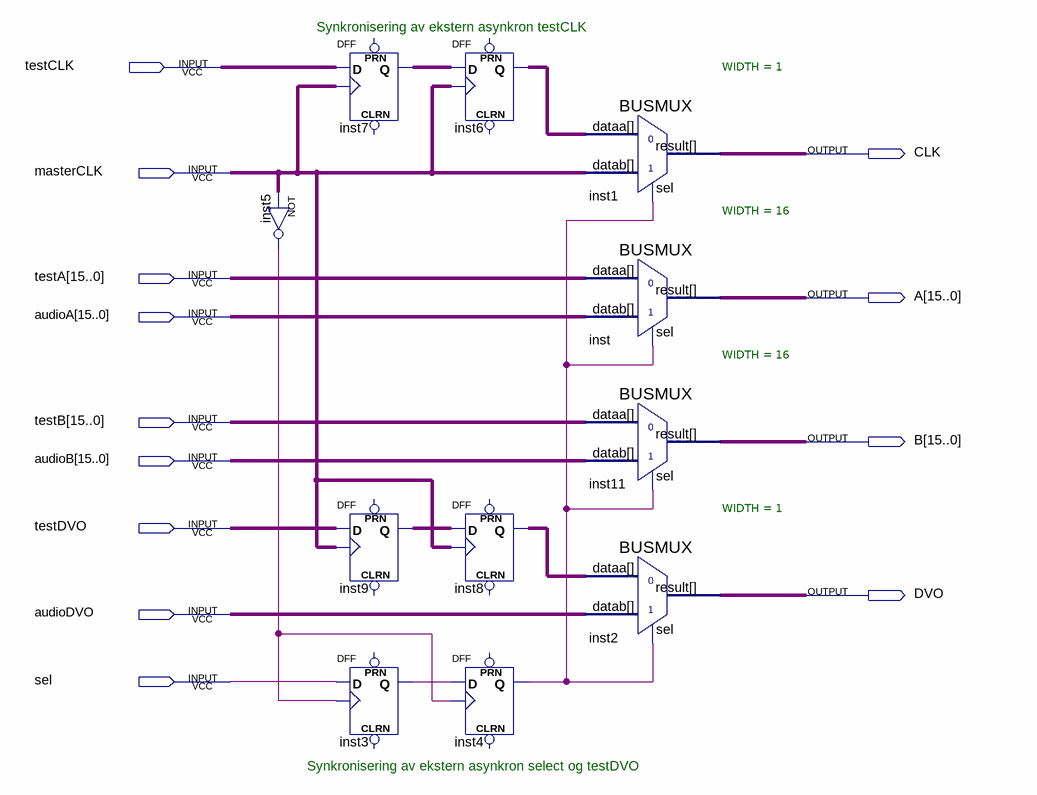
[diagram p0: schematic sheet]
// Quartus schematic wb_dataCtrlMux.bdf as structural Verilog: 11 symbols, 13 pins
module wb_dataCtrlMux (
  input  testCLK,
  input  masterCLK,
  input  [15:0] testA,
  input  [15:0] audioA,
  input  [15:0] testB,
  input  [15:0] audioB,
  input  testDVO,
  input  audioDVO,
  input  sel,
  output CLK,
  output [15:0] A,
  output [15:0] B,
  output DVO
);

  wire inst3_q, inst4_q, inst5_out, inst6_q, inst7_q, inst8_q, inst9_q;

  not inst5 (inst5_out, masterCLK);
  DFF inst7 (.CLK(masterCLK), .D(testCLK), .Q(inst7_q));  // open: CLRN, PRN
  DFF inst9 (.CLK(masterCLK), .D(testDVO), .Q(inst9_q));  // open: CLRN, PRN
  DFF inst3 (.CLK(inst5_out), .D(sel), .Q(inst3_q));  // open: CLRN, PRN
  DFF inst6 (.CLK(masterCLK), .D(inst7_q), .Q(inst6_q));  // open: CLRN, PRN
  DFF inst8 (.CLK(masterCLK), .D(inst9_q), .Q(inst8_q));  // open: CLRN, PRN
  DFF inst4 (.CLK(inst5_out), .D(inst3_q), .Q(inst4_q));  // open: CLRN, PRN
  BUSMUX #(.WIDTH(1)) inst1 (.datab(masterCLK), .sel(inst4_q), .dataa(inst6_q), .result(CLK));
  BUSMUX #(.WIDTH(16)) inst (.datab(audioA), .sel(inst4_q), .dataa(testA), .result(A));
  BUSMUX #(.WIDTH(16)) inst11 (.datab(audioB), .sel(inst4_q), .dataa(testB), .result(B));
  BUSMUX #(.WIDTH(1)) inst2 (.datab(audioDVO), .sel(inst4_q), .dataa(inst8_q), .result(DVO));

  // Notes on the sheet:
  //   Synkronisering av ekstern asynkron testCLK
  //   Synkronisering av ekstern asynkron select og testDVO
endmodule
